# Altium project BISHE.PrjPcb
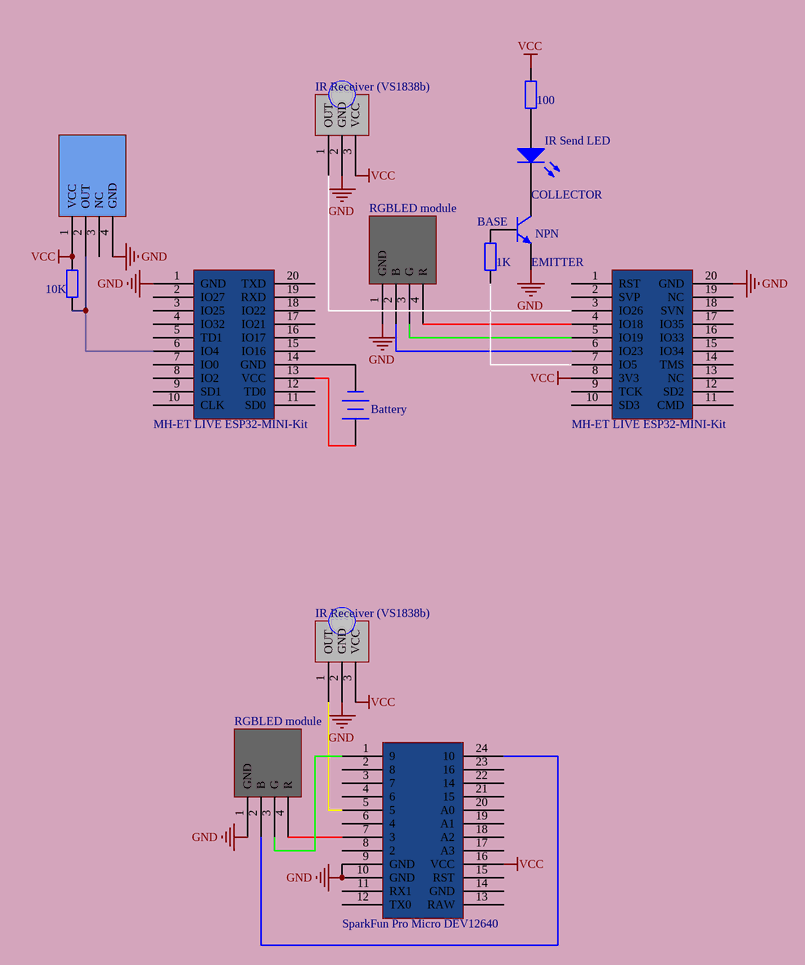
[diagram p0: BISHE.SchDoc]
1 sheet, 14 parts. Net scope: global (net labels, ports and power ports of the same name join across sheets).

## Sheet BISHE.SchDoc
size A4 portrait

### Parts
(Parts that share a designator on the sheet are numbered #1, #2 ... from top to bottom, then left to right.)
*#1  IR Receiver (VS1838b)
*#2  DHT11  (value not drawn)
*?  IR Receiver (VS1838b)
BT?  Battery  [BAT-2]
D?  LED0  [LED-0]  (value not drawn)
ESP32?#1  MH-ET LIVE ESP32-MINI-Kit  (part A of 2)
ESP32?#2  MH-ET LIVE ESP32-MINI-Kit  (part B of 2)
Pro_Micro_?  SparkFun Pro Micro DEV12640
Q1  NPN  [TO-226-AA]
R1  value 100  [AXIAL-0.4]  (hidden comment: Res2)
R2  value 1K  [AXIAL-0.4]  (hidden comment: Res2)
R?  value 10K  [AXIAL-0.4]  (hidden comment: Res2)
RGBLED_module1  RGBLED module
RGBLED_module2  RGBLED module

### Nets
GND: *#1.2(GND) *#2.4(GND) *?.2(GND) ESP32?#1.1(GND) ESP32?#2.20(GND) Pro_Micro_?.9(GND) Pro_Micro_?.10(GND) Q1.3(E) RGBLED_module1.1(GND) RGBLED_module2.1(GND)
VCC: *#1.3(VCC) *#2.1(VCC) *?.3(VCC) ESP32?#2.8(3V3) Pro_Micro_?.16(VCC) R1.2 R?.2
Net*#1_1: *#1.1(OUT) ESP32?#2.3(IO26)
Net*#2_2: *#2.2(OUT) ESP32?#1.6(IO4) R?.1
Net*?_1: *?.1(OUT) Pro_Micro_?.5
NetBT?_1: BT?.1(+) ESP32?#1.13(VCC)
NetBT?_2: BT?.2(-) ESP32?#1.14(GND)
NetD?_1: D?.1(A) R1.1
NetD?_2: D?.2(K) Q1.1(C)
NetESP32?#2_4: ESP32?#2.4(IO18) RGBLED_module1.4(R)
NetESP32?#2_5: ESP32?#2.5(IO19) RGBLED_module1.3(G)
NetESP32?#2_6: ESP32?#2.6(IO23) RGBLED_module1.2(B)
NetESP32?#2_7: ESP32?#2.7(IO5) R2.1
NetPro_Micro_?_1: Pro_Micro_?.1(9) RGBLED_module2.3(G)
NetPro_Micro_?_7: Pro_Micro_?.7(3) RGBLED_module2.4(R)
NetPro_Micro_?_24: Pro_Micro_?.24(10) RGBLED_module2.2(B)
NetQ1_2: Q1.2(B) R2.2

Not connected (* = marked no-connect by the designer): *#2 3(NC); ESP32?#1 2(IO27) 3(IO25) 4(IO32) 5(TD1) 7(IO0) 8(IO2) 9(SD1) 10(CLK) 11(SD0) 12(TD0) 15(IO16) 16(IO17) 17(IO21) 18(IO22) 19(RXD) 20(TXD); ESP32?#2 1(RST) 2(SVP) 9(TCK) 10(SD3) 11(CMD) 12(SD2) 13(NC) 14(TMS) 15(IO34) 16(IO33) 17(IO35) 18(SVN) 19(NC); Pro_Micro_? 2(8) 3(7) 4(6) 6(4) 8(2) 11(RX1) 12(TX0) 13(RAW) 14(GND) 15(RST) 17(A3) 18(A2) 19(A1) 20(A0) 21(15) 22(14) 23(16)

### Notes on the sheet
- (near Q1) COLLECTOR
- (near D?) IR Send LED
- BASE
- (near Q1) EMITTER

### Library data of the parts
*#1 *? = VS1838b
BT? = Battery: Multicell Battery; Published: 24-Mar-1999; LatestRevisionDate: 17-Jul-2002; LatestRevisionNote: Re-released for DXP Platform.; PackageReference: BAT-2; Publisher: Altium Limited; PackageDescription: Battery; 2 Leads
D? = LED0: Typical INFRARED GaAs LED; Published: 8-Jun-2000; LatestRevisionDate: 08-Jul-2005; LatestRevisionNote: Mech Layer 1 removed.; PackageReference: LED-0; Publisher: Altium Limited; PackageDescription: LED; 2 Leads
ESP32?#1 ESP32?#2 = ESP32
Pro_Micro_? = Pro Micro
Q1 = NPN: NPN Bipolar Transistor; Published: 8-Jun-2000; LatestRevisionDate: 17-Jul-2002; LatestRevisionNote: Re-released for DXP Platform.; PackageReference: TO-226-AA; Publisher: Altium Limited; PackageDescription: TO, Flat Index; 3 In-Line, Axial Leads; Body Dia. 4.8mm; Leads 0.55 x 0.51 mm (max); Code_JEDEC: TO-226-AA
R1 R2 R? = Res2: Resistor; Published: 8-Jun-2000; LatestRevisionDate: 17-Jul-2002; LatestRevisionNote: Re-released for DXP Platform.; PackageReference: AXIAL-0.4; Publisher: Altium Limited; PackageDescription: Axial Device, Thru-Hole; 2 Leads; 0.4 in Pin Spacing